# Altium project OMODRI.PrjPcb (part 1 of 5)
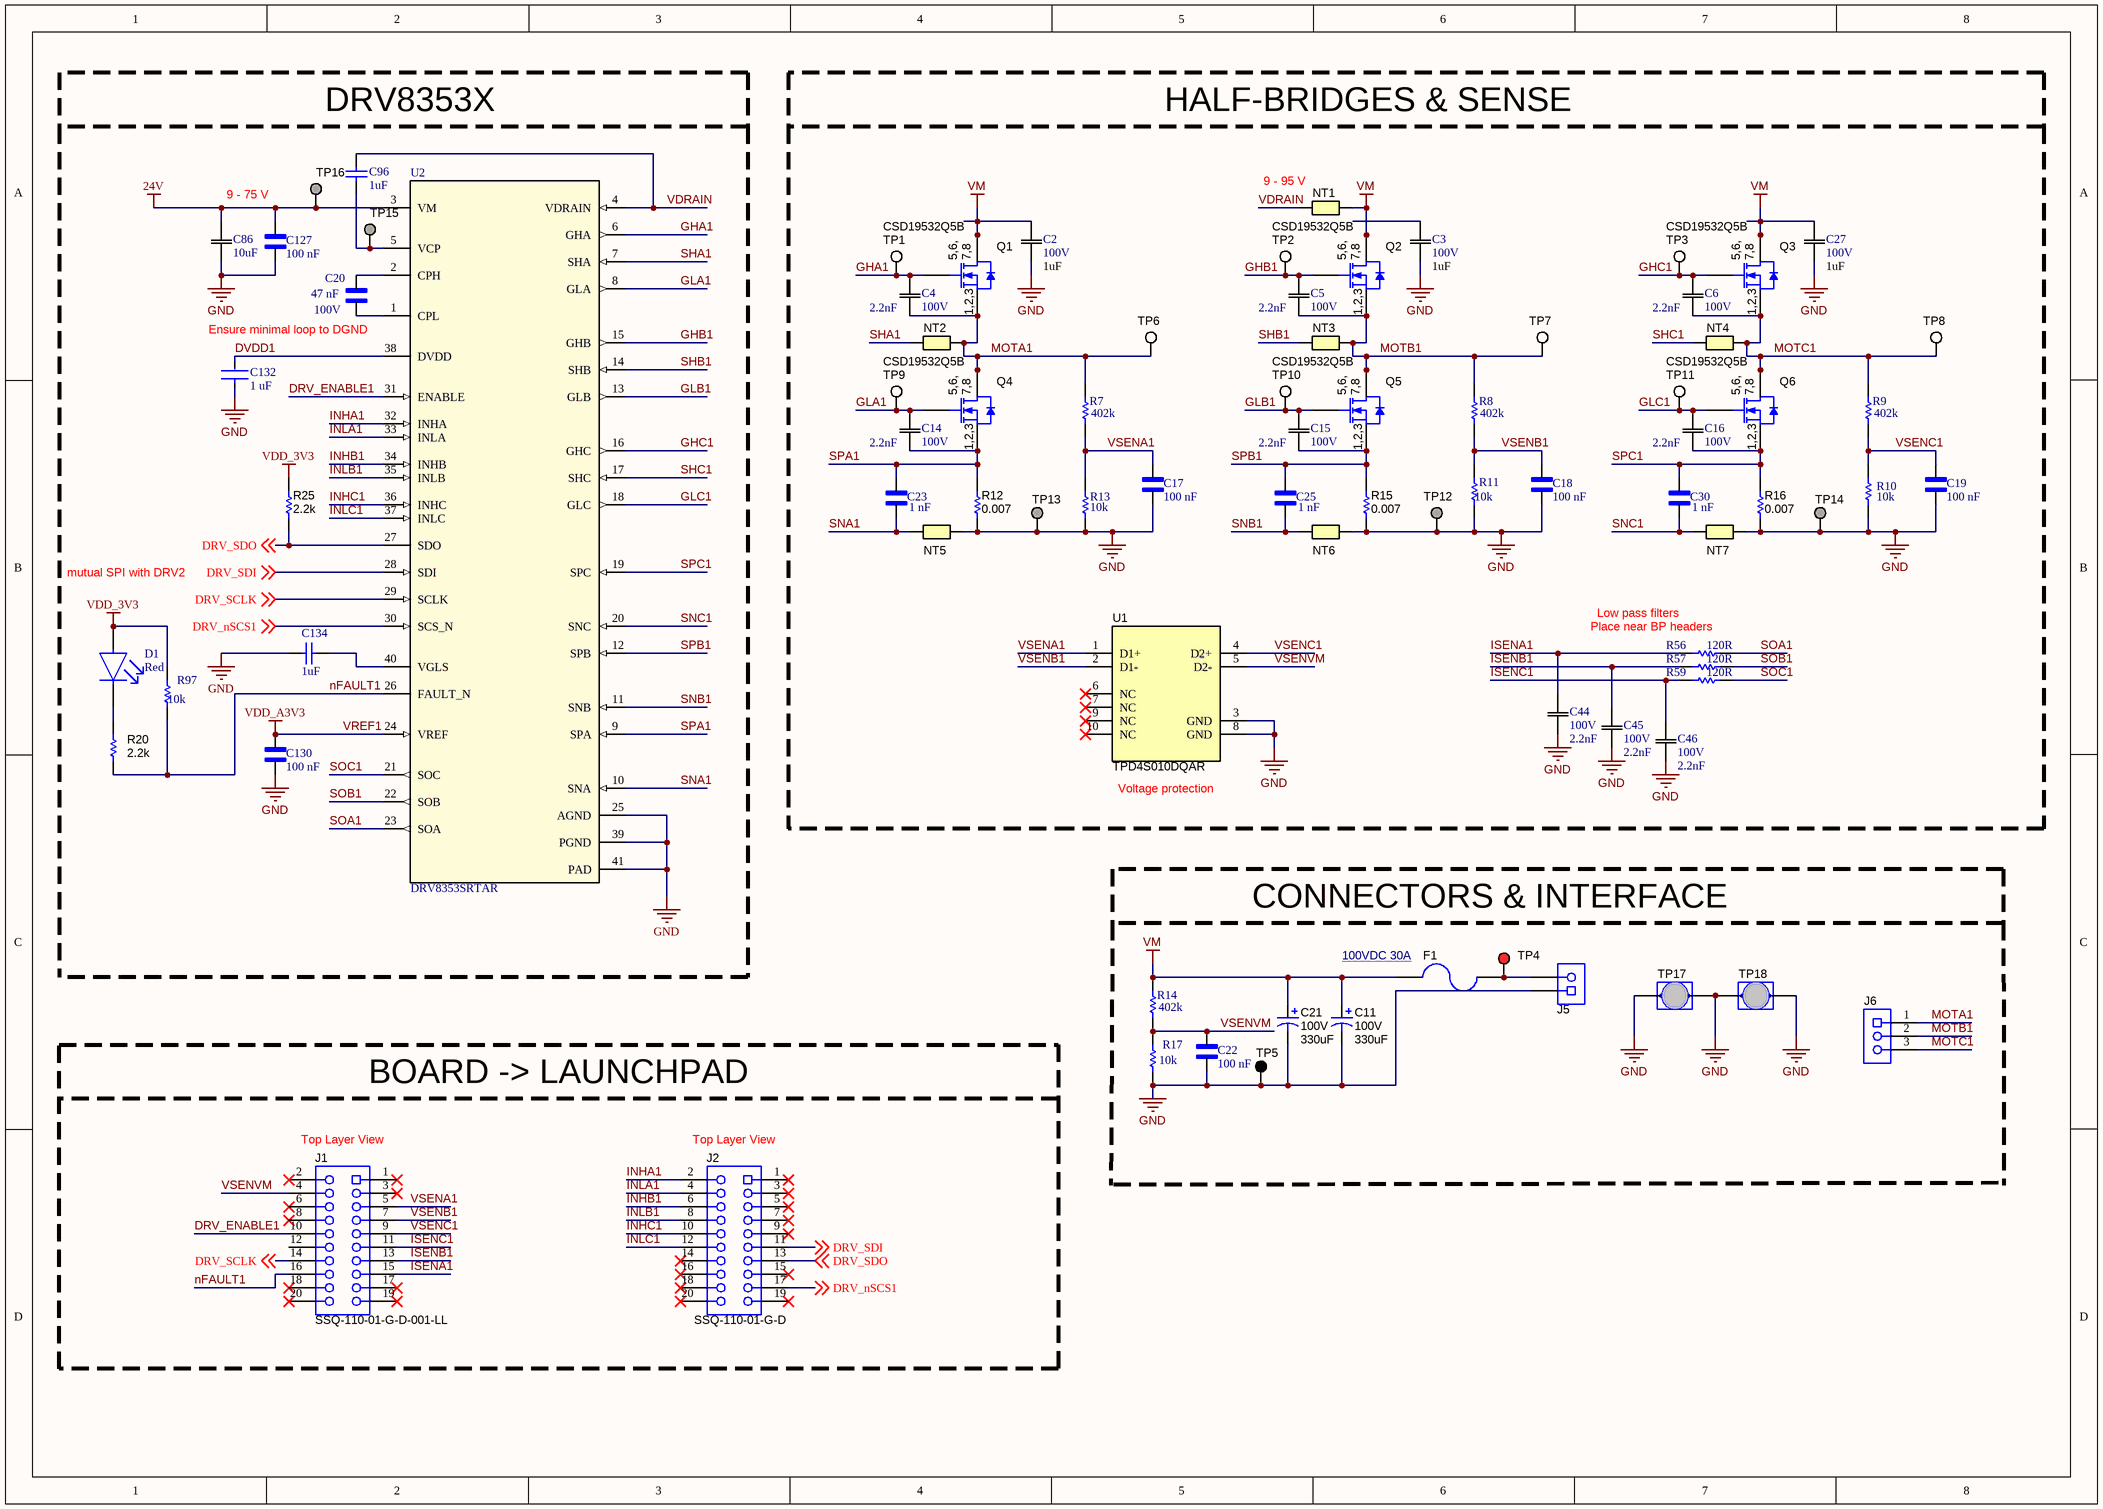
[diagram p0: OMODRI_Gate_Driver_1.SchDoc]
10 sheets, 421 parts. Net scope: flat (ports and power ports of the same name join across sheets).
Sheets:
  OMODRI_Gate_Driver_1.SchDoc
  OMODRI_Gate_Driver_2.SchDoc
  OMODRI_QuadEnc.SchDoc
  OMODRI_BiSSEnc.SchDoc
  OMODRI_EnDATEnc.SchDoc
  OMODRI_EtherCAT_0.SchDoc
  OMODRI_EtherCAT_1.SchDoc
  OMODRI_Power.SchDoc
  OMODRI_Support.SchDoc
  OMODRI_GPIO.SchDoc

## Sheet OMODRI_Gate_Driver_1.SchDoc
size A3; Date: Not shown in title block; ApprovedBy: Not shown in title block; CheckedBy: Not shown in title block; Author: Not shown in title block; CompanyName: Not shown in title block; Engineer: Not shown in title block; Organization: Not shown in title block; Address1: Not shown in title block; Address2: Not shown in title block; Address3: Not shown in title block; Address4: Not shown in title block; DocumentNumber: 1; Revision: Use project parameter SCH_Rev; SheetNumber: 1; SheetTotal: 4; PageSetup: Record=PageOptions|CenterHorizontal=True|CenterVertical=True|PrintScale=1.00|XCorrection=1.00|YCorrection=1.00|PrintKind=0|BorderSize=5000000|LeftOffset=0|BottomOffset=0|Orientation=2|PaperLength=1000|PaperWidth=1000|Scale=100|PaperSource=15|PrintQuality=600|MediaType=1|DitherType=10|PaperKind=Letter|PrintScaleMode=1; CurrentTime: Not shown in title block; CurrentDate: Not shown in title block; Time: Not shown in title block; DocumentFullPathAndName: Not shown in title block; DocumentName: Not shown in title block; ModifiedDate: Not shown in title block; ImagePath: Not shown in title block

### Parts
C2  value 1uF  Voltage: 100V  [0805_AVX]  (hidden comment: Part Number: 08051C102K4Z2A)
C3  value 1uF  Voltage: 100V  [0805_AVX]  (hidden comment: Part Number: 08051C102K4Z2A)
C4  Voltage Rating (DC): 100V  Capacitance: 2.2nF  [CAP_1005]  (hidden comment: Part Number: C1005X8R2A222K050BA)
C5  Voltage Rating (DC): 100V  Capacitance: 2.2nF  [CAP_1005]  (hidden comment: Part Number: C1005X8R2A222K050BA)
C6  Voltage Rating (DC): 100V  Capacitance: 2.2nF  [CAP_1005]  (hidden comment: Part Number: C1005X8R2A222K050BA)
C11  VDC_V: 100V  ValueDisplayed: 330uF  [SM_RADIAL_K16]  (hidden comment: EEV-FK2A331M)
C14  Voltage Rating (DC): 100V  Capacitance: 2.2nF  [CAP_1005]  (hidden comment: Part Number: C1005X8R2A222K050BA)
C15  Voltage Rating (DC): 100V  Capacitance: 2.2nF  [CAP_1005]  (hidden comment: Part Number: C1005X8R2A222K050BA)
C16  Voltage Rating (DC): 100V  Capacitance: 2.2nF  [CAP_1005]  (hidden comment: Part Number: C1005X8R2A222K050BA)
C17  value 100 nF  [CAPC0603X33N]  (hidden comment: GRM033R61E104KE14D)
C18  value 100 nF  [CAPC0603X33N]  (hidden comment: GRM033R61E104KE14D)
C19  value 100 nF  [CAPC0603X33N]  (hidden comment: GRM033R61E104KE14D)
C20  value 47 nF  Voltage: 100V  [CAPC1608X90N]  (hidden comment: GCG188R92A473KA01D)
C21  VDC_V: 100V  ValueDisplayed: 330uF  [SM_RADIAL_K16]  (hidden comment: EEV-FK2A331M)
C22  value 100 nF  [CAPC0603X33N]  (hidden comment: GRM033R61E104KE14D)
C23  value 1 nF  [CAPC0603X33N]  (hidden comment: GRM033R71H102KA12D)
C25  value 1 nF  [CAPC0603X33N]  (hidden comment: GRM033R71H102KA12D)
C27  value 1uF  Voltage: 100V  [0805_AVX]  (hidden comment: Part Number: 08051C102K4Z2A)
C30  value 1 nF  [CAPC0603X33N]  (hidden comment: GRM033R71H102KA12D)
C44  Voltage Rating (DC): 100V  Capacitance: 2.2nF  [CAP_1005]  (hidden comment: Part Number: C1005X8R2A222K050BA)
C45  Voltage Rating (DC): 100V  Capacitance: 2.2nF  [CAP_1005]  (hidden comment: Part Number: C1005X8R2A222K050BA)
C46  Voltage Rating (DC): 100V  Capacitance: 2.2nF  [CAP_1005]  (hidden comment: Part Number: C1005X8R2A222K050BA)
C86  Capacitance: 10uF  [CAP_CL10]  (hidden comment: Part Number: CL10A106MA8NRNC)
C96  value 1uF  [CAPC1005X55X25ML05T10]  (hidden comment: GRM155R61C105KA12D)
C127  value 100 nF  [CAPC0603X33N]  (hidden comment: GRM033R61E104KE14D)
C130  value 100 nF  [CAPC0603X33N]  (hidden comment: GRM033R61E104KE14D)
C132  value 1 uF  [FP-CC0201-BA-MFG]  (hidden comment: CC0201MRX5R5BB105)
C134  value 1uF  [CAPC1005X55X25ML05T10]  (hidden comment: GRM155R61C105KA12D)
D1  Colour: Red  [FP-SML-P1-MFG]  (hidden comment: SML-P11UTT86R)
F1  100VDC 30A  [Fuse_0463]
J1  SSQ-110-01-G-D-001-LL  [Samtec_SSQ-110-01-x-D-001-LL]
J2  SSQ-110-01-G-D  [Samtec_SSQ-110-01-x-D]
J5  1902547  [Phoenix_1902547]  (value not drawn)
J6  1904150  [Phoenix_1904150]  (value not drawn)
NT1  Net-Tie  [Net-Tie_50milWide_30milLong]  (value not drawn)  (net tie, no BOM)
NT2  Net-Tie  [Net-Tie_10mil]  (value not drawn)  (net tie, no BOM)
NT3  Net-Tie  [Net-Tie_10mil]  (value not drawn)  (net tie, no BOM)
NT4  Net-Tie  [Net-Tie_10mil]  (value not drawn)  (net tie, no BOM)
NT5  Net-Tie  [Net-Tie_10mil]  (value not drawn)  (net tie, no BOM)
NT6  Net-Tie  [Net-Tie_10mil]  (value not drawn)  (net tie, no BOM)
NT7  Net-Tie  [Net-Tie_10mil]  (value not drawn)  (net tie, no BOM)
Q1  CSD19532Q5B  [DNK0008A]
Q2  CSD19532Q5B  [DNK0008A]
Q3  CSD19532Q5B  [DNK0008A]
Q4  CSD19532Q5B  [DNK0008A]
Q5  CSD19532Q5B  [DNK0008A]
Q6  CSD19532Q5B  [DNK0008A]
R7  Resistance: 402k  [RESC1005X40X25LL05T05]  (hidden comment: ERJ-2RKF4023X)
R8  Resistance: 402k  [RESC1005X40X25LL05T05]  (hidden comment: ERJ-2RKF4023X)
R9  Resistance: 402k  [RESC1005X40X25LL05T05]  (hidden comment: ERJ-2RKF4023X)
R10  Resistance: 10k  [RESC1005X40X25LL05T05]  (hidden comment: ERJ2RKF1002X)
R11  Resistance: 10k  [RESC1005X40X25LL05T05]  (hidden comment: ERJ2RKF1002X)
R12  ValueDisplayed: 0.007  [CRE2512-R5_R9]  (hidden comment: CRE2512-FZ-R007E-3)
R13  Resistance: 10k  [RESC1005X40X25LL05T05]  (hidden comment: ERJ2RKF1002X)
R14  Resistance: 402k  [RESC1005X40X25LL05T05]  (hidden comment: ERJ-2RKF4023X)
R15  ValueDisplayed: 0.007  [CRE2512-R5_R9]  (hidden comment: CRE2512-FZ-R007E-3)
R16  ValueDisplayed: 0.007  [CRE2512-R5_R9]  (hidden comment: CRE2512-FZ-R007E-3)
R17  Resistance: 10k  [RESC1005X40X25LL05T05]  (hidden comment: ERJ2RKF1002X)
R20  ValueDisplayed: 2.2k  [0402]  (hidden comment: CRCW04022K20JNED)
R25  ValueDisplayed: 2.2k  [0402]  (hidden comment: CRCW04022K20JNED)
R56  Resistance: 120R  [RESC1005X40X25ML05T10]  (hidden comment: CRCW0402120RJNEDHP)
R57  Resistance: 120R  [RESC1005X40X25ML05T10]  (hidden comment: CRCW0402120RJNEDHP)
R59  Resistance: 120R  [RESC1005X40X25ML05T10]  (hidden comment: CRCW0402120RJNEDHP)
R97  Resistance: 10k  [RESC1005X40X25LL05T05]  (hidden comment: ERJ2RKF1002X)
TP1  5002  [Keystone5002]  (value not drawn)
TP2  5002  [Keystone5002]  (value not drawn)
TP3  5002  [Keystone5002]  (value not drawn)
TP4  5000  [Keystone5000]  (value not drawn)
TP5  5001  [Keystone5001]  (value not drawn)
TP6  5002  [Keystone5002]  (value not drawn)
TP7  5002  [Keystone5002]  (value not drawn)
TP8  5002  [Keystone5002]  (value not drawn)
TP9  5002  [Keystone5002]  (value not drawn)
TP10  5002  [Keystone5002]  (value not drawn)
TP11  5002  [Keystone5002]  (value not drawn)
TP12  TP_SM_1MM  [TP_SM_1MM]  (value not drawn)  (no BOM)
TP13  TP_SM_1MM  [TP_SM_1MM]  (value not drawn)  (no BOM)
TP14  TP_SM_1MM  [TP_SM_1MM]  (value not drawn)  (no BOM)
TP15  TP_SM_1MM  [TP_SM_1MM]  (value not drawn)  (no BOM)
TP16  TP_SM_1MM  [TP_SM_1MM]  (value not drawn)  (no BOM)
TP17  D3082-05  [Harwin_D3082-05]  (value not drawn)
TP18  D3082-05  [Harwin_D3082-05]  (value not drawn)
U1  TPD4S010DQAR  [DQA0010A]
U2  DRV8353SRTAR  [RTA0040B]

### Blocks framed on the sheet
BOARD -> LAUNCHPAD: J1 J2

### Nets
24V: C86.2 C127.2 TP16.1 U2.3(VM)
GND: C2.1 C3.1 C11.2(-) C17.1 C18.1 C19.1 C21.2(-) C22.1 C27.1 C44.1 C45.1 C46.1 C86.1 C127.1 C130.1 C132.1 C134.2 J5.1 NT5.2 NT6.2 NT7.2 R10.1 R11.1 R12.1 R13.1 R15.1 R16.1 R17.1 TP5.1 TP12.1 TP13.1 TP14.1 TP17.1 TP17.2 TP18.1 TP18.2 U1.3(GND) U1.8(GND) U2.25(AGND) U2.39(PGND) U2.41(PAD)
VDD_3V3: D1.2(A) R25.1 R97.2
VM: C2.2 C11.1(+) C21.1(+) C27.2 F1.2 NT1.2 Q1.5(D) Q1.6(D) Q1.7(D) Q1.8(D) Q1.9(D) Q2.5(D) Q2.6(D) Q2.7(D) Q2.8(D) Q2.9(D) Q3.5(D) Q3.6(D) Q3.7(D) Q3.8(D) Q3.9(D) R14.2
VREF1: C130.2 U2.24(VREF)  [also labelled VDD_A3V3]
DRV_ENABLE1: J1.10 U2.31(ENABLE)
DRV_nSCS1: J2.17 U2.30(SCS_N) ; off-sheet DRV_nSCS1
DRV_SCLK: J1.14 U2.29(SCLK) ; off-sheet DRV_SCLK
DRV_SDI: J2.11 U2.28(SDI) ; off-sheet DRV_SDI
DRV_SDO: J2.13 R25.2 U2.27(SDO) ; off-sheet DRV_SDO
DVDD1: C132.2 U2.38(DVDD)
GHA1: C4.2 Q1.4(G) TP1.1 U2.6(GHA)
GHB1: C5.2 Q2.4(G) TP2.1 U2.15(GHB)
GHC1: C6.2 Q3.4(G) TP3.1 U2.16(GHC)
GLA1: C14.2 Q4.4(G) TP9.1 U2.8(GLA)
GLB1: C15.2 Q5.4(G) TP10.1 U2.13(GLB)
GLC1: C16.2 Q6.4(G) TP11.1 U2.18(GLC)
INHA1: J2.2 U2.32(INHA)
INHB1: J2.6 U2.34(INHB)
INHC1: J2.10 U2.36(INHC)
INLA1: J2.4 U2.33(INLA)
INLB1: J2.8 U2.35(INLB)
INLC1: J2.12 U2.37(INLC)
ISENA1: C44.2 J1.15 R56.2
ISENB1: C45.2 J1.13 R57.2
ISENC1: C46.2 J1.11 R59.2
MOTA1: C4.1 J6.1 NT2.2 Q1.1(S) Q1.2(S) Q1.3(S) Q4.5(D) Q4.6(D) Q4.7(D) Q4.8(D) Q4.9(D) R7.2 TP6.1
MOTB1: C5.1 J6.2 NT3.2 Q2.1(S) Q2.2(S) Q2.3(S) Q5.5(D) Q5.6(D) Q5.7(D) Q5.8(D) Q5.9(D) R8.2 TP7.1
MOTC1: C6.1 J6.3 NT4.2 Q3.1(S) Q3.2(S) Q3.3(S) Q6.5(D) Q6.6(D) Q6.7(D) Q6.8(D) Q6.9(D) R9.2 TP8.1
nFAULT1: J1.16 R20.1 R97.1 U2.26(FAULT_N)
SHA1: NT2.1 U2.7(SHA)
SHB1: NT3.1 U2.14(SHB)
SHC1: NT4.1 U2.17(SHC)
SNA1: C23.1 NT5.1 U2.10(SNA)
SNB1: C25.1 NT6.1 U2.11(SNB)
SNC1: C30.1 NT7.1 U2.20(SNC)
SOA1: R56.1 U2.23(SOA)
SOB1: R57.1 U2.22(SOB)
SOC1: R59.1 U2.21(SOC)
SPA1: C14.1 C23.2 Q4.1(S) Q4.2(S) Q4.3(S) R12.2 U2.9(SPA)
SPB1: C15.1 C25.2 Q5.1(S) Q5.2(S) Q5.3(S) R15.2 U2.12(SPB)
SPC1: C16.1 C30.2 Q6.1(S) Q6.2(S) Q6.3(S) R16.2 U2.19(SPC)
VDRAIN: C96.1 NT1.1 U2.4(VDRAIN)
VSENA1: C17.2 J1.5 R7.1 R13.2 U1.1(D1+)
VSENB1: C18.2 J1.7 R8.1 R11.2 U1.2(D1-)
VSENC1: C19.2 J1.9 R9.1 R10.2 U1.4(D2+)
VSENVM: C22.2 J1.4 R14.1 R17.2 U1.5(D2-)
NetC20_1: C20.1 U2.1(CPL)
NetC20_2: C20.2 U2.2(CPH)
NetC96_2: C96.2 TP15.1 U2.5(VCP)
NetC134_1: C134.1 U2.40(VGLS)
NetD1_1: D1.1(C) R20.2
NetF1_1: F1.1 J5.2 TP4.1

Not connected (* = marked no-connect by the designer): C3 2; J1 1* 2* 3* 6* 8* 12 17* 18* 19* 20*; J2 1* 3* 5* 7* 9* 14* 15* 16* 18* 19* 20*; U1 6(NC)* 7(NC)* 9(NC)* 10(NC)*

### Notes on the sheet
- (near C96) DRV8353X
- HALF-BRIDGES & SENSE
- (near NT1) 9 - 95 V
- 9 - 75 V
- Ensure minimal loop to DGND
- mutual SPI with DRV2
- Low pass filters
- Place near BP headers
- (near U1) Voltage protection
- CONNECTORS & INTERFACE
- (near J1) Top Layer View
- (near J2) Top Layer View
- Title
- Size:
- Date:
- A3
- Number:
- Time:
- Revision:
- Sheet
- of
- File:
- (in symbol CMP-0000958-3) 5,6,; 7,8; 1,2,3

### Library data of the parts
C2 C3 C27 = 08051C105K4Z2A: Cap Ceramic 1uF 100V X7R 10% Pad SMD 0805 Soft Termination 125C Automotive T/R; Manufacturer: Kyocera AVX; Vendor: AVX Corporation; Built_By: EMA_UL_Team; SourceLibrary: AVX_2015-1-12; Type: DEV; Manufacturer_Part_Number: 08051C102K4Z2A; Copyright: Copyright (C) 2018 Accelerated Designs. All rights reserved; RefDes: RefDes; Supplier 1: Digi-Key; Manufacturer Part Number: 08051C105K4Z2A; RoHS: No; Stock 1: 20840; Pricing 1: 1=0,47000, 10=0,32500, 100=0,19490, 500=0,14616, 1000=0,12343 (USD); Supplier Part Number 1: 478-12143-1-ND
C4-C6 C14-C16 C44-C46 = C1005X8R2A222K05: CAP CER 2200PF 100V X8R 0402; Vendor: TDK; Built_By: EMA_UL_Team; Type: DEV; Tolerance: 10%; Manufacturer_Part_Number: C1005X8R2A222K050BA; Copyright: Copyright (C) 2018 Accelerated Designs. All rights reserved; RefDes: RefDes; Value: Value; Supplier 1: Digi-Key; Manufacturer: TDK; Manufacturer Part Number: C1005X8R2A222K050BA; RoHS: Yes; Category: Ceramic Capacitors; Stock 1: 14105; Pricing 1: 1=0,28000, 10=0,19000, 100=0,10750, 500=0,07590, 1000=0,06641, 2500=0,06325, 5000=0,05851 (USD); Mount: Surface Mount; Case/Package: 0402; Weight: 2.3E-05oz; Case Code (Imperial): 0402; Case Code (Metric): 1005; Min Operating Temperature: -55°C; Max Operating Temperature: 150°C; Packaging: Tape and Reel; Features: High Temperature; Termination: SMD/SMT; Package Quantity: 10000; Dielectric: X8R; Length: 0.039inch; Height: 0.5mm; Thickness: 0.022inch; Width: 0.5mm; ComponentLink1URL: http://www.mouser.com/ds/2/400/mlcc_commercial_hightemp_en-348760.pdf?src-supplier=Mouser; ComponentLink1Description: http://www.mouser.com/ds/2/400/mlcc_commercial_hightemp_en-348760.pdf?src-supplier=Mouser; ComponentLink2URL: http://product.tdk.com/en/catalog/datasheets/mlcc_commercial_hightemp_en.pdf?src-supplier=Avnet; ComponentLink2Description: http://product.tdk.com/en/catalog/datasheets/mlcc_commercial_hightemp_en.pdf?src-supplier=Avnet; ComponentLink3URL: https://product.tdk.com/info/en/catalog/datasheets/mlcc_commercial_hightemp_en.pdf?src-supplier=Digi-Key; ComponentLink3Description: https://product.tdk.com/info/en/catalog/datasheets/mlcc_commercial_hightemp_en.pdf?src-supplier=Digi-Key; ComponentLink4URL: https://product.tdk.com/info/en/catalog/spec/mlccspec_commercial_hightemp_en.pdf?src-supplier=Digi-Key; ComponentLink4Description: https://product.tdk.com/info/en/catalog/spec/mlccspec_commercial_hightemp_en.pdf?src-supplier=Digi-Key; Supplier Part Number 1: 445-15913-1-ND; Voltage Rating: 100V
C11 C21 = CMP-0011224-2: CAP, AL, 330 uF, 100 V, +/- 20%, 0.153 ohm, AEC-Q200 Grade 2, SMD; Manufacturer: Panasonic; TaMin_C: -55°C; ESR_ohm: 1.53d; Polarized: Y; SizeAreaWB_mm2: 483; U/M: EA; Value: 330uF; TaMax_C: 105°C; SizeZ_mm: 16.5; SizeX_mm: 21; SizeY_mm: 19; Cap_Case: K16; SizeArea_mm2: 399; CompType: Capacitor; Cap_F: 330µF; IRMS_A: 9.17dA; AEC Grade: 2; AEC Category: Q200; Supplier Part Number 2: 667-EEV-FK2A331M; Publisher: Texas Instruments; Supplier 2: Mouser; RoHS: Y; Value1: 0.153 ohm; MountType: SMT; Supplier 1: Digi-Key; PackageReference: SMT Radial K16; Tolerance_%: 20%; Value2: 100V; LatestRevisionDate: 2017-03-09; PartNumber: EEV-FK2A331M; AEC Qualified: Y; Series: FK; ComponentLink1Description: Datasheet link; Supplier Part Number 1: PCE3505CT-ND; Technology: AL; ComponentLink1URL: https://industrial.panasonic.com/cdbs/www-data/pdf/RDE0000/ABA0000C1181.pdf
C17-C19 C22 C127 C130 = GRM033R61E104KE14D: SMD Capacitor X5R_EIA_ with Capacitance: 0.10uF Tol. 10%. Rated Voltage: 25Vdc; MF: Murata; SnapEDA_Link: https://www.snapeda.com/parts/GRM033R61E104KE14D/Murata/view-part/4375622/?ref=snap; Availability: Unavailable; MP: GRM033R61E104KE14D; Package: 0603 Taiyo Yuden; Price: None
C20 = GCG188R92A473KA01D: SMD Capacitor X8R_EIA_ with Capacitance: 47000pF Tol. 10%. Rated Voltage: 100Vdc; MF: Murata; Digi-Key_Part_Number: 490-GCG188R92A473KA01DCT-ND; SnapEDA_Link: https://www.snapeda.com/parts/GCG188R92A473KA01D/Murata/view-part/1805926/?ref=snap; Package: 1608 Murata; MP: GCG188R92A473KA01D; Digi-Key_Purchase_URL: https://www.digikey.com/product-detail/en/murata-electronics/GCG188R92A473KA01D/490-GCG188R92A473KA01DCT-ND/11619134?utm_source=snapeda&utm_medium=aggregator&utm_campaign=symbol
C23 C25 C30 = GRM033R71H102KA12D: SMD Capacitor X7R_EIA_ with Capacitance: 1000pF Tol. 10%. Rated Voltage: 50Vdc; MF: Murata; Digi-Key_Part_Number: 490-10682-1-ND; MP: GRM033R71H102KA12D; SnapEDA_Link: https://www.snapeda.com/parts/GRM033R71H102KA12D/Murata/view-part/4374985/?ref=snap; Package: 0603 Taiyo Yuden; Digi-Key_Purchase_URL: https://www.digikey.com/product-detail/en/murata-electronics/GRM033R71H102KA12D/490-10682-1-ND/5251423?utm_source=snapeda&utm_medium=aggregator&utm_campaign=symbol
C86 = CL10A106MA8NRNC: CAP CER 10UF 25V X5R 0603; Vendor: Samsung; Built_By: EMA_Rocco; Type: DEV; Tolerance: 20%; Manufacturer_Part_Number: CL10A106MA8NRNC; Copyright: Copyright (C) 2018 Accelerated Designs. All rights reserved; RefDes: RefDes; Value: Value; Supplier 1: Digi-Key; Manufacturer: Samsung; Manufacturer Part Number: CL10A106MA8NRNC; RoHS: Yes; Category: Ceramic Capacitors; Stock 1: 30323; Pricing 1: 1=0,36000, 10=0,24900, 100=0,14120, 500=0,09966, 1000=0,08720 (USD); Mount: Surface Mount; Case/Package: 0603; Case Code (Imperial): 0603; Contact Plating: Tin; Case Code (Metric): 1608; Min Operating Temperature: -55°C; Max Operating Temperature: 85°C; Dielectric: X5R; Termination: Wraparound; Package Quantity: 1; Packaging: Tape and Reel; Voltage Rating: 25V; Length: 0.063inch; Thickness: 0.035inch; Width: 0.031inch; Lead Free: Lead Free; ComponentLink1URL: https://datasheet.ciiva.com/25766/cl10a106ma8nrnc-25766562.pdf?src-supplier=Digi-Key; ComponentLink1Description: https://datasheet.ciiva.com/25766/cl10a106ma8nrnc-25766562.pdf?src-supplier=Digi-Key
C96 C134 = CMP-2008-04573-1: Manufacturer: Murata; Part Number: GRM155R61C105KA12D
C132 = CMP-03422-000660-1: CAP CER 1UF 6.3V X5R 0201; Manufacturer: Yageo; Material: Ceramic; Tolerance: 0.2; Temperature Coefficient: 15%; Lead Free: Yes; Capacitance: 1 uF; ComponentLink2URL: http://www.yageo.com/documents/recent/UPY-GPHC_X5R_4V-to-50V_25.pdf; Footprint Url: http://www.yageo.com/exep/pages/download/literatures/UPY-C_GEN_24.pdf; Temperature Range Low: -55°C; Category: Cap; Device Class L3: Ceramic Capacitors; Device Class L2: Capacitors; Digikey Description: CAP CER 1UF 6.3V X5R 0201; Automotive: No; Temperature: -55°C to +85°C; RoHS: TRUE; Octopart: https://octopart.com/cc0201mrx5r5bb105-yageo-33242268; Height: 0.33mm; Temperature Range High: +85°C; Temperature Characteristic: X5R; Device Class L1: Passive Components; Package: CC0201-BA; ComponentLink2Description: Datasheet; Manufacturer Part Number: CC0201MRX5R5BB105; Voltage Rating: 6.3 V; Mouser Description: Multilayer Ceramic Capacitors MLCC - SMD/SMT 1.0uF 6.3V X5R 20%; Ipc Land Pattern Name: CAPC6030X30
D1 = SML-P11UTT86R: LED, PICOLED, Red, SMD, 1 mA, 1.8 V, 621 nm; Manufacturer Part Number: SML-P11VTT86R; Manufacturer: Rohm; Led Orientation: Top View; Power Dissipation: 50mW; Wavelength: 626nm; Forward Voltage: 1.8V; Forward Current: 1mA; Luminous Intensity: 4mcd; Reverse Voltage: 5V; Lens Color: Colorless; Lens Style: Square,Diffused,Colorless; Number of LEDs: 1; Lens Transparency: Clear; Dominant Wavelength: 621nm; ComponentLink2URL: https://www.rohm.com/datasheet/SML-P11VT(R)/sml-p11-e; Temperature: -40°C to +85°C; Device Class L2: LEDs; Package: SML-P1; Category: Diode; Automotive: No; RoHS: TRUE; Lead Free: Yes; Digikey Description: LED RED CLEAR 1006 SMD; Device Class L3: unset; ComponentLink2Description: Datasheet; Octopart: https://octopart.com/sml-p11vtt86r-rohm-34112314; Device Class L1: Optoelectronics; Temperature Range High: +85°C; Temperature Range Low: -40°C; Mouser Description: SML-P11 Series Red 0402 Clear 4 mcd 1.8 V Surface Mount PICOLED? LED; Height: 0.25mm; Supplier 1: Digi-Key; Stock 1: 132; Pricing 1: 1=0,39000, 10=0,27600, 100=0,16100, 500=0,11040, 1000=0,09200, 2500=0,08280 (USD); Mount: Surface Mount; Case/Package: 0402; Number of Pins: 2; Color: Red; Packaging: Cut Tape; Test Current: 1mA; Length: 1mm; Width: 0.6mm; REACH SVHC: Unknown; ComponentLink1URL: https://datasheet.ciiva.com/48679/sml-p11-p-eco-48679068.pdf?src-supplier=Avnet; ComponentLink1Description: https://datasheet.ciiva.com/48679/sml-p11-p-eco-48679068.pdf?src-supplier=Avnet; Supplier Part Number 1: SML-P11UTT86RCT-ND
F1 = CMP-0077200-3: Fuse, 30 A, 250 VAC, 100 VDC, SMD; PartNumber: 0463030.ER; Manufacturer: Littelfuse; VAC_V: 250V; SizeAreaWB_mm2: 61.952; Rtyp_Ohm: 1.93m; SizeArea_mm2: 31.512; MeltingTyp: 916; SizeZ_mm: 3.12; VDC_V: 100V; SizeX_mm: 10.1; Interrupt_AC: 100A; Interrupt_DC: 50A; Fuse Speed: Fast; Fuse Technology: Board Mount; TaMax_C: 125°C; TaMin_C: -55°C; ComponentLink1Description: Datasheet URL; RoHS: Y; Supplier Part Number 3: 576-0463030.ER; Supplier 1: Digi-Key; Irating_A: 30A; PackageReference: 10.1x3.12mm; Supplier Part Number 2: 64W8551; Supplier 2: Newark; SizeY_mm: 3.12; ComponentLink1URL: http://www.littelfuse.com/~/media/electronics/datasheets/fuses/littelfuse_fuse_463_datasheet.pdf.pdf; CompType: Fuse; MountType: SMT; Supplier Part Number 1: F6439CT-ND; Supplier 3: Mouser
J1 = CMP-0082628-1: Receptacle, 2.54mm, 10x2, Gold, TH; Manufacturer: Samtec; Pitch_mm: 2.54; Gender: Female; Cert_UL: Y; Voltage_V: 465V; Current_A: 6.3A; Row_Count: 2; CompType: Socket Strip; ComponentLink1Description: Datasheet URL; RoHS: Y; Orientation: Vertical; PackageReference: Receptacle, 2.54mm, 10x2, TH; Color: Black; PartNumber: SSQ-110-01-G-D-001-LL; PinCount: 20; ContactFinish: Gold; RowSpacing_mm: 2.54; ComponentLink1URL: http://suddendocs.samtec.com/catalog_english/ssq_th.pdf; MountType: TH
J2 = CMP-0082605-1: Receptacle, 2.54mm, 10x2, Gold, TH; Manufacturer: Samtec; Pitch_mm: 2.54; Gender: Female; Cert_UL: Y; Voltage_V: 465V; Current_A: 6.3A; Row_Count: 2; CompType: Socket Strip; ComponentLink1Description: Datasheet URL; RoHS: Y; Supplier Part Number 3: 1668306; Supplier 1: Digi-Key; Orientation: Vertical; PackageReference: Receptacle, 2.54mm, 10x2, TH; Color: Black; PartNumber: SSQ-110-01-G-D; PinCount: 20; Supplier Part Number 2: 11P8367; ContactFinish: Gold; Supplier 2: Newark; RowSpacing_mm: 2.54; ComponentLink1URL: http://suddendocs.samtec.com/prints/ssq-1xx-xx-xxx-x-xx-xxx-xx-x-mkt.pdf; MountType: TH; Supplier Part Number 1: SAM1179-10-ND; Supplier 3: Farnell
J5 = CMP-0055527-1: Terminal Block, 9.52mm, 2x1, R/A, TH; Manufacturer: Phoenix Contact; Pitch_mm: 9.52; Gender: Female; Row_Count: 1; Current_A: 32A; Voltage_V: 1kV; Cert_UL: Y; CNHeader: FALSE; CT: TRUE; PartNumber: 1902547; PackageReference: Terminal Block, 2x1, Pitch 9.52mm; CompType: Terminal Block; RoHS: Y; MountType: TH; ComponentLink1Description: Datasheet URL; ComponentLink1URL: https://www.phoenixcontact.com/online/portal/in?uri=pxc-oc-itemdetail:pid=1902547&library=inen&tab=1&requestType=product&product; Publisher: Texas Instruments; LatestRevisionDate: 26/05/2017; Supplier 1: Digi-Key; Supplier Part Number 1: 277-5951-ND; Supplier 2: Mouser; Supplier Part Number 2: 651-1902547; Orientation: R/A; PinCount: 2; Color: Green; Cert_VDE: Y
J6 = CMP-0055528-1: Terminal Block, 9.52mm, 3x1, R/A, TH; Manufacturer: Phoenix Contact; Pitch_mm: 9.52; Gender: Female; Row_Count: 1; Current_A: 32A; Voltage_V: 1kV; Cert_UL: Y; CNHeader: FALSE; CT: TRUE; PartNumber: 1904150; PackageReference: Terminal Block, 3x1, Pitch 9.52mm; CompType: Terminal Block; RoHS: Y; MountType: TH; ComponentLink1Description: Datasheet URL; ComponentLink1URL: https://www.phoenixcontact.com/online/portal/in?uri=pxc-oc-itemdetail:pid=1904150&library=inen&pcck=P-11-01-05&tab=1; Publisher: Texas Instruments; LatestRevisionDate: 26/05/2017; Supplier 1: Digi-Key; Supplier Part Number 1: 277-6184-ND; Supplier 2: Newark; Supplier Part Number 2: 15X2516; Supplier 3: Mouser; Supplier Part Number 3: 651-1904150; Orientation: R/A; PinCount: 3; Color: Green; Cert_VDE: Y
NT1-NT7 = CMP-0078142-1: Single point connection between nets.; MountType: SMT; PackageReference: N/A; CompType: Net-Tie; Manufacturer: N/A; PartNumber: N/A; Library Reference: Net-Tie
Q1-Q6 = CMP-0000958-3: MOSFET, N-CH, 100 V, 17 A, DNK0008A (VSON-CLIP-8); Manufacturer: Texas Instruments; Alternate Manufacturer: None; U/M: EA; ChType: N; Value: 100V; Value2: 48 nC; QgTyp_nC: 48; Vgs_V: 20V; IdsMax_A: 17A; SizeAreaWB_mm2: 56; SizeArea_mm2: 30; SizeX_mm: 6; SizeY_mm: 5; SizeZ_mm: 1; AEC Category: Q101; CompType: MOSFET; PartNumber: CSD19532Q5B; PackageReference: DNK0008A; VdsMax_V: 100V; RoHS: Y; MountType: SMT; ComponentLink1Description: Datasheet link; ComponentLink1URL: http://www.ti.com/lit/ds/symlink/csd19532q5b.pdf; Supplier 1: Digi-Key; Supplier Part Number 1: 296-37478-6-ND; Supplier 2: Farnell; Supplier Part Number 2: 2413268; AEC Qualified: N
R7-R9 R14 = CMP-2002-00920-1: RES SMD 402K OHM 1% 1/10W 0402; Manufacturer: Panasonic; Part Number: ERJ-2RKF4023X
R10 R11 R13 R17 R97 = CMP-2000-07588-1: Chip Resistor, 10 KOhm, +/- 1%, 0.1 W, -55 to 155 degC, 0402 (1005 Metric), RoHS, Tape and Reel; Manufacturer: Panasonic; Power Rating: 100mW; Voltage Rating: 50V; Case\/Package: 0402; Temperature Coefficient: 100ppm\/degreesC; RoHSCompliant: True; Lead Free: LeadFree; Package Quantity: 1; Contact Plating: Tin; Length: 1mm; Radiation Hardening: No; REACH SVHC: NoSVHC; Max Operating Temperature: 155degC; Depth: 0.5mm; Case Code (Imperial): 0402; Military Standard: Not; Package Description: 2-Pin Surface Mount Device, Body 1 x 0.5 mm; Termination: SMD/SMT; Case Code (Metric): 1005; Height: 0.35mm; Packaging: TapeandReel; Voltage Rating (DC): 50V; Package Reference: 402; Number of Pins: 2; Tolerance: 1%; Mounting Technology: SurfaceMount; Width: 0.02inch; Mount: SurfaceMount; Datasheet URL: https://industrial.panasonic.com/cdbs/www-data/pdf/RDA0000/AOA0000C304.pdf; Composition: ThickFilm; Datasheet Version: 02/2017; Manufacturer URL: http://www.panasonic.com/; Max Power Dissipation: 100mW; Number of Terminations: 2; Min Operating Temperature: -55degC
R12 R15 R16 = CMP-0074664-1: RES, 0.007, 1%, 3 W, AEC-Q200 Grade 0, 2512; Manufacturer: Bourns; Value: 0.007; Res_ohm: 7m; Value_Code: 7L000; Power_W: 3W; TempCo: 50 ppm/C; EIA_Code: E96; U/M: EA; AEC Category: Q200; AEC Grade: 0; AEC Qualified: Y; Green_Lifecycle: Active; Green_REACh: Passed; SizeArea_mm2: 21.6075; SizeX_mm: 6.45; SizeY_mm: 3.35; SizeZ_mm: 0.9; CompType: Resistor; PartNumber: CRE2512-FZ-R007E-3; PackageReference: 2512; RoHS: Y; Tolerance_%: 1%; Value1: 1%; Value2: 3W; MountType: SMT; Technology: Metal Film; Published: 2008-06-26; Publisher: Texas Instruments; LatestRevisionDate: 2017-06-26; ComponentLink1Description: Datasheet link; ComponentLink1URL: http://www.bourns.com/docs/Product-Datasheets/CRE.pdf; Supplier 1: Digi-Key; Supplier Part Number 1: CRE2512-FZ-R007E-3CT-ND; Supplier 2: Newark; Supplier Part Number 2: 78X4876; Supplier 3: Mouser; Supplier Part Number 3: 652-CRE2512FZR007E-3; Green_EU RoHS-2: Incomplete; Green_EU RoHS: Passed
R20 R25 = CMP-0026890-5: RES, 2.2 k, 5%, 0.063 W, AEC-Q200 Grade 0, 0402; Manufacturer: Vishay-Dale; Power_W: 63mW; TempCo: 200 ppm/C; Value_Code: 2k20; Value: 2.2k; EIA_Code: E24; SizeX_mm: 1; SizeY_mm: 0.5; SizeZ_mm: 0.6; Value2: 0.063W; AEC Qualified: Y; VDC_V: 50V; AEC Category: Q200; AEC Grade: 0; Supplier Part Number 2: 59M6710; Supplier 2: Newark; Supplier Part Number 3: 71-CRCW0402J-2.2K-E3; Supplier 3: Mouser; RoHS: E; Value1: 5%; MountType: SMT; Supplier 1: Digi-Key; PackageReference: 0402; Tolerance_%: 5%; Res_ohm: 2.2k; SizeArea_mm2: 0.5; CompType: Resistor; PartNumber: CRCW04022K20JNED; ComponentLink1Description: Datasheet link; Supplier Part Number 1: 541-2.2KJCT-ND; Technology: Thick Film; ComponentLink1URL: http://www.vishay.com/docs/20035/dcrcwe3.pdf
R56 R57 R59 = CRCW0402120RJNEDHP: RES SMD 120 OHM 5% 1/5W 0402; Manufacturer: Vishay Dale; Power Rating: 125mW; Voltage Rating: 50V; Temperature Coefficient: 200ppm/°C; Part Number: CRCW0402120RJNEDHP; Supplier 1: Digi-Key; Manufacturer Part Number: CRCW0402120RJNEDHP; RoHS: Yes; Category: Chip SMD Resistors; Stock 1: 18750; Pricing 1: 1=0,13000, 10=0,11300, 100=0,04350, 1000=0,01912, 2500=0,01651, 5000=0,01477 (USD); Case/Package: 0402; Weight: 2.3E-05oz; Case Code (Metric): 1005; Case Code (Imperial): 0402; Min Operating Temperature: -55°C; Max Operating Temperature: 155°C; Package Quantity: 1; Tolerance: 5%; Packaging: Tape and Reel; Composition: Thick Film; Max Power Dissipation: 125mW; Features: Automotive AEC-Q200; Number of Terminations: 2; Termination: SMD/SMT; Military Standard: Not; Length: 1mm; Height: 0.016inch; Width: 0.02inch; Depth: 0.5mm; Lead Free: Lead Free; ComponentLink1URL: https://datasheet.ciiva.com/12577/crcwhpe3-46056-12577101.pdf?src-supplier=Mouser; ComponentLink1Description: https://datasheet.ciiva.com/12577/crcwhpe3-46056-12577101.pdf?src-supplier=Mouser; ComponentLink2URL: https://datasheet.ciiva.com/6548/crcwhpe3-6548111.pdf?src-supplier=Digi-Key; ComponentLink2Description: https://datasheet.ciiva.com/6548/crcwhpe3-6548111.pdf?src-supplier=Digi-Key; Supplier Part Number 1: 541-120YACT-ND
TP1-TP3 TP6-TP11 = CMP-0055139-1: Test Point, Miniature, White, TH; Manufacturer: Keystone; ContactFinish: Silver; CNHeader: FALSE; CT: TRUE; Green_Lifecycle: Active; Green_REACh: Passed; PartNumber: 5002; PackageReference: White Miniature Testpoint; CompType: Test Point; RoHS: Y; MountType: TH; ComponentLink1Description: Datasheet URL; ComponentLink1URL: http://www.keyelco.com/userAssets/file/M60-2p60.pdf; Publisher: Texas Instruments; LatestRevisionDate: 26/05/2017; Supplier 1: Digi-Key; Supplier Part Number 1: 36-5002-ND; Supplier 2: Newark; Supplier Part Number 2: 82H9632; Supplier 3: Mouser; Supplier Part Number 3: 534-5002; Color: White; Green_EU RoHS-2: Passed; Green_EU RoHS: Passed
TP4 = CMP-0055137-1: Test Point, Miniature, Red, TH; Manufacturer: Keystone; ContactFinish: Silver; CNHeader: FALSE; CT: TRUE; Green_Lifecycle: Active; Green_REACh: Passed; PartNumber: 5000; PackageReference: Red Miniature Testpoint; CompType: Test Point; RoHS: Y; MountType: TH; ComponentLink1Description: Datasheet URL; ComponentLink1URL: http://www.keyelco.com/userAssets/file/M60-2p60.pdf; Publisher: Texas Instruments; LatestRevisionDate: 26/05/2017; Supplier 1: Digi-Key; Supplier Part Number 1: 36-5000-ND; Supplier 2: Mouser; Supplier Part Number 2: 534-5000; Color: Red; Green_EU RoHS-2: Incomplete; Green_EU RoHS: Passed
TP5 = CMP-0055138-1: Test Point, Miniature, Black, TH; Manufacturer: Keystone; CNHeader: FALSE; Green_Lifecycle: Active; Green_REACh: Passed; ContactFinish: Silver; CT: TRUE; ComponentLink1URL: http://www.keyelco.com/userAssets/file/M60-2p60.pdf; Supplier Part Number 2: 534-5001; Publisher: Texas Instruments; Supplier 2: Mouser; Color: Black; RoHS: Y; MountType: TH; Green_EU RoHS-2: Incomplete; Supplier 1: Digi-Key; Green_EU RoHS: Passed; PackageReference: Black Miniature Testpoint; CompType: Test Point; LatestRevisionDate: 26/05/2017; PartNumber: 5001; ComponentLink1Description: Datasheet URL; Supplier Part Number 1: 36-5001-ND
TP12-TP16 = CMP-0003825-1: 1mm Test Point, SMT; Manufacturer: Any; ComponentLink1URL: https://sps06.itg.ti.com/sites/KMS/crossdivteams/altium/docs/ComponentDatasheets/PROBE_TEST_POINT.png; Key: TP_SM_1MM; Publisher: Texas Instruments; CompType: Test Point; PackageReference: 1mm Test Point, SMT; LatestRevisionDate: 2017-03-09; MountType: SMT; PartNumber: TP_SM_1MM; ComponentLink1Description: Datasheet Link
TP17 TP18 = CMP-0075110-1: 1mm Uninsulated Shorting Plug, 10.16mm spacing, TH; Manufacturer: Harwin; CompType: Jumper Wire; CNHeader: False; Green_Lifecycle: Active; Green_REACh: Passed; PartNumber: D3082-05; PackageReference: Shorting Plug, 10.16mm spacing, TH; RoHS: Y; MountType: TH; ComponentLink1Description: Datasheet URL; ComponentLink1URL: http://cdn.harwin.com/pdfs/D3080-D3083.pdf; Publisher: Texas Instruments; LatestRevisionDate: 2017-07-12; Supplier 1: Digi-Key; Supplier Part Number 1: 952-1873-ND; Supplier 2: Newark; Supplier Part Number 2: 01E9240; Supplier 3: Mouser; Supplier Part Number 3: 855-D3082-05; CT: False; Green_EU RoHS-2: Passed; Green_EU RoHS: Passed with Exemption
U1 = CMP-0043121-2: ESD Solution for High-Speed Differential Interface, 4 Channels, -40 to +85 degC,10-pin SON (DQA), Green (RoHS & no Sb/Br); Manufacturer: Texas Instruments; IO Leakage Current(nA): 10; IO Capacitance(Typ)(pF): 0.8; 1394 / Firewire: TRUE; Breakdown Voltage(Min)(V): 9; Differential Capacitance(pF): 0.05; IEC 61000-4-2 Contact(+/- kV): 8; ComponentLink1URL: http://www.ti.com/; PackageDescription: 10-Pin Plastic Small Outline No-Lead, 1 x 2.5 x 0.55 mm Body, 0.5 mm Pitch; ComponentLink2URL: http://www.ti.com/general/docs/lit/getliterature.tsp?genericPartNumber=TPD4S010&fileType=pdf; Serial ATA / eSATA: TRUE; ComponentLink3Description: URL Link1; Eco-Plan: Green (RoHS & no Sb/Br); ComponentLink2Description: Datasheet; ComponentLink3URL: SamplesURL:http://www.ti.com/product/tpd4s010#samples; PackageReference: DQA0010A; DatasheetVersion: SLVS817E; SubFamily: ESD Solution; PartNumber: TPD4S010DQAR; PackageVersion: revB, Sep-2009; Mounting Technology: Surface Mount; ComponentLink1Description: Manufacturer URL; IEC 61000-4-2 Air-Gap(+/- kV): 9
U2 = DRV8353SRTAR: Manufacturer: Texas Instruments; PartNumber: DRV8353SRTAR; RefDes: RefDes; TYPE: TYPE; Value: Value; Supplier 1: Arrow; Manufacturer Part Number: DRV8353SRTAR; RoHS: No; Stock 1: 2000; Pricing 1: 2000=3,20540, 4000=3,09430, 10000=3,08440, 50000=3,06460 (USD); Supplier Part Number 1: DRV8353SRTAR